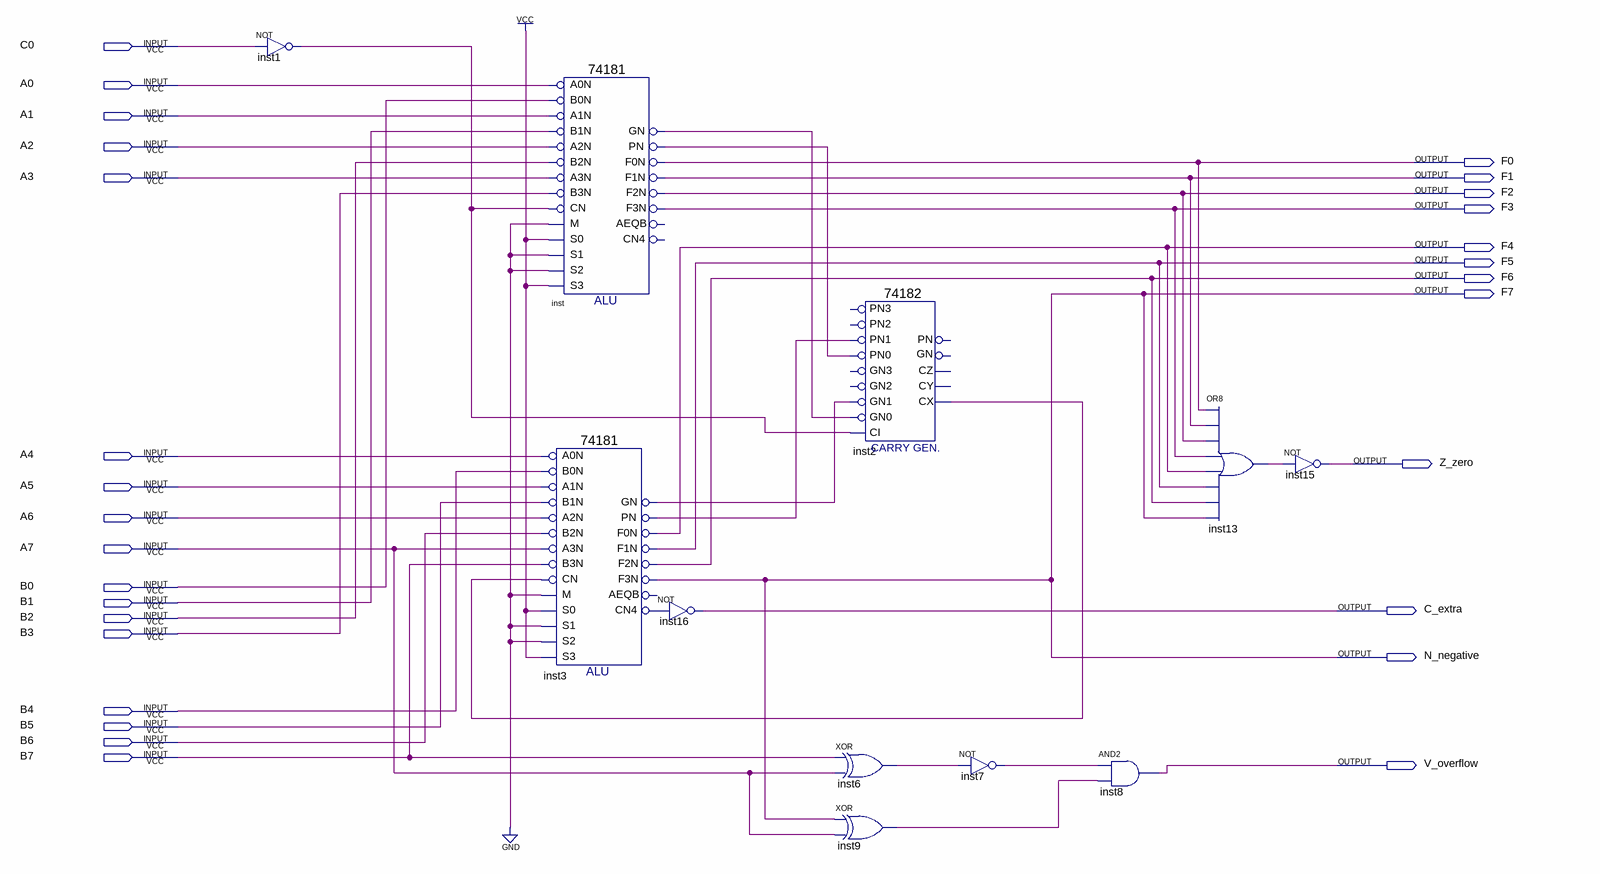
[diagram p0: schematic sheet]
// Quartus schematic alu.bdf as structural Verilog: 11 symbols, 29 pins
module alu (
  input  C0,
  input  A0,
  input  A1,
  input  A2,
  input  A3,
  input  A4,
  input  A5,
  input  A6,
  input  A7,
  input  B0,
  input  B1,
  input  B2,
  input  B3,
  input  B4,
  input  B5,
  input  B6,
  input  B7,
  output F0,
  output F1,
  output F2,
  output F3,
  output F4,
  output F5,
  output F6,
  output F7,
  output Z_zero,
  output C_extra,
  output N_negative,
  output V_overflow
);

  wire inst1_out, inst2_cx, inst3_cn4, inst3_gn, inst3_pn, inst6_out, inst7_out, inst9_out, inst13_out,
       inst_gn, inst_pn;

  not inst1 (inst1_out, C0);
  \74181  inst (
    .B0N(B0), .A0N(A0), .A1N(A1), .B1N(B1), .A3N(A3), .B2N(B2), .A2N(A2), .M(1'b0), .CN(inst1_out), .B3N(B3),
    .S2(1'b0), .S1(1'b0), .S0(1'b1), .S3(1'b1), .PN(inst_pn), .GN(inst_gn), .F3N(F3), .F1N(F1), .F0N(F0),
    .F2N(F2));  // open: AEQB, CN4
  \74181  inst3 (
    .B0N(B4), .A0N(A4), .A1N(A5), .B1N(B5), .A3N(A7), .B2N(B6), .A2N(A6), .M(1'b0), .CN(inst2_cx), .B3N(B7),
    .S2(1'b0), .S1(1'b0), .S0(1'b1), .S3(1'b1), .PN(inst3_pn), .GN(inst3_gn), .F3N(F7), .F1N(F5), .F0N(F4),
    .CN4(inst3_cn4), .F2N(F6));  // open: AEQB
  not inst16 (C_extra, inst3_cn4);
  \74182  inst2 (
    .CI(inst1_out), .PN1(inst3_pn), .PN0(inst_pn), .GN1(inst3_gn), .GN0(inst_gn), .CX(inst2_cx));  // open: PN2, GN2, GN3, PN3, CY, PN, CZ, GN
  xor inst6 (inst6_out, B7, A7);
  xor inst9 (inst9_out, F7, A7);
  not inst7 (inst7_out, inst6_out);
  and inst8 (V_overflow, inst7_out, inst9_out);
  or inst13 (inst13_out, F0, F1, F2, F3, F4, F5, F6, F7);
  not inst15 (Z_zero, inst13_out);

  assign N_negative = F7;
endmodule
